# EAGLE design SatUplink-Voltera (EAGLE 8.2.2)
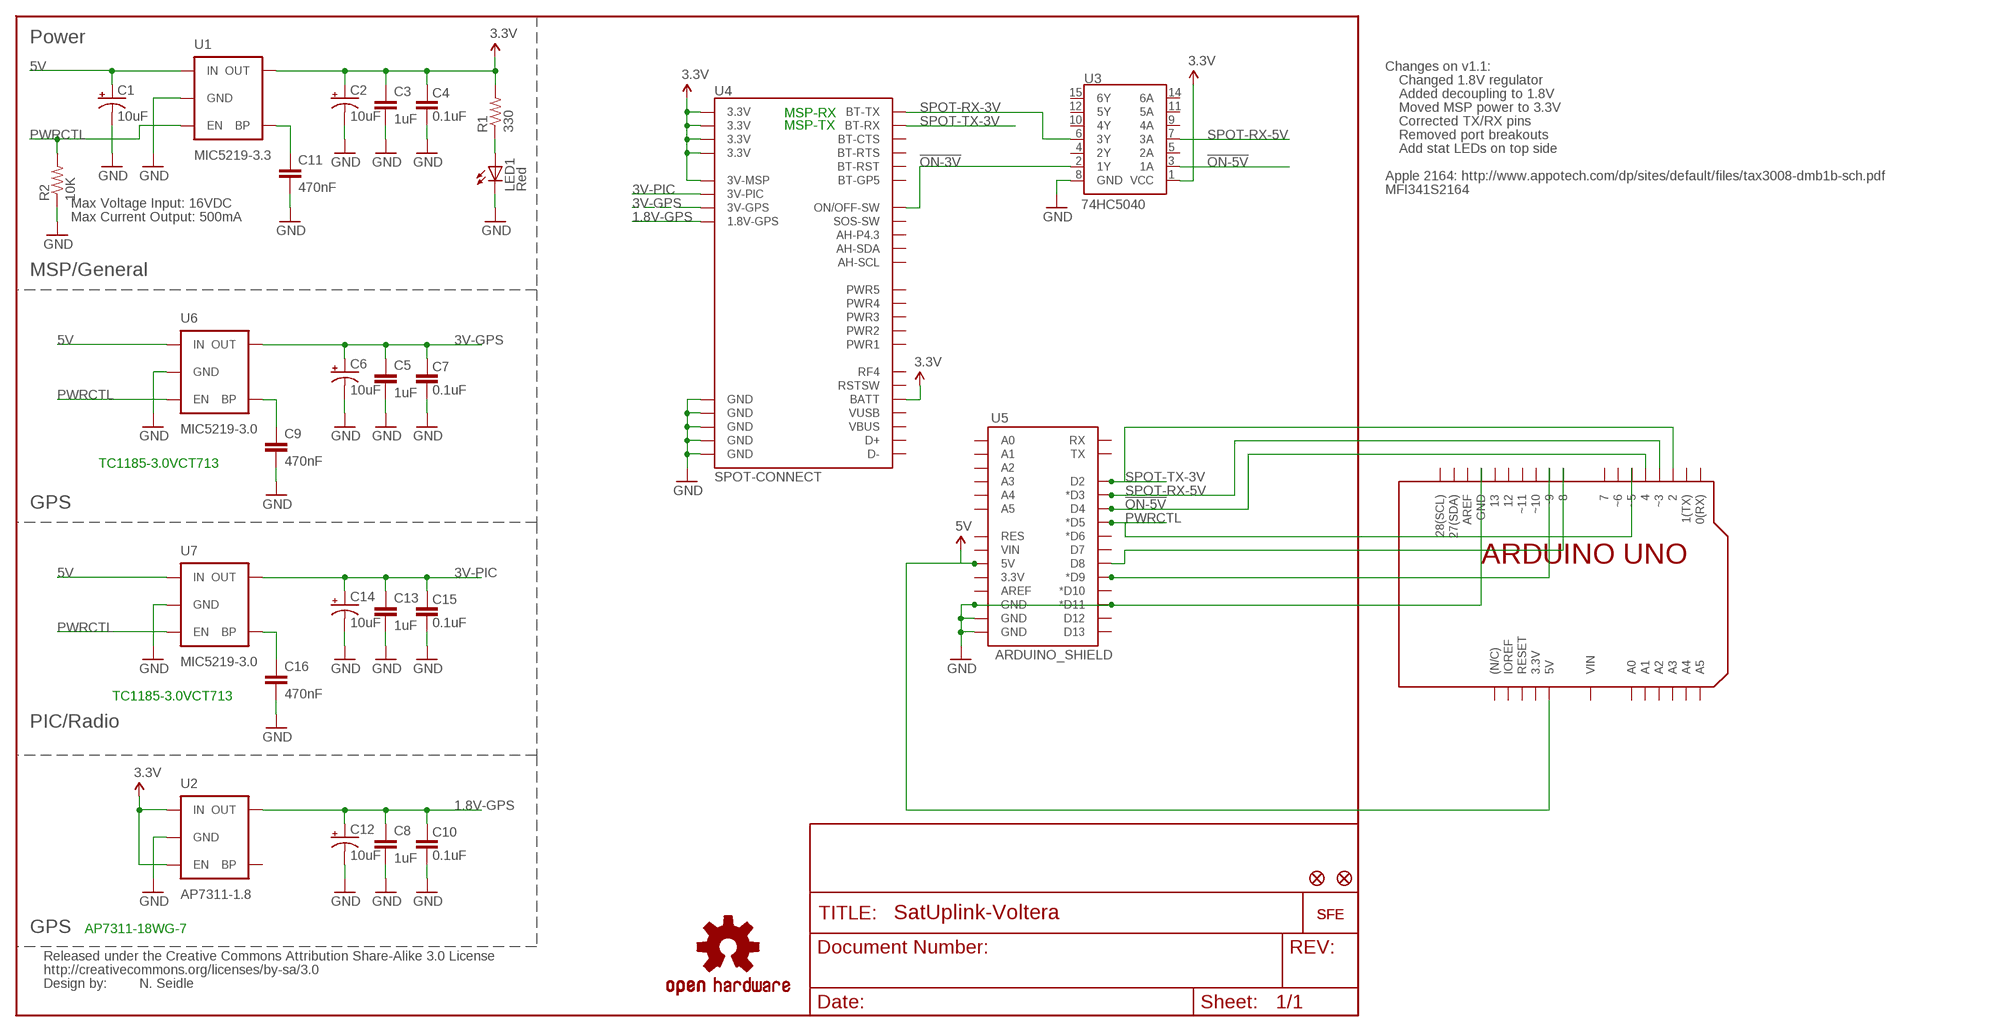
[diagram p0: schematic, sheet 1]

## Parts
C1  10uF  CAP_POL1206  [EIA3216]
C2  10uF  CAP_POL1206  [EIA3216]
C3  1uF  CAP0402-CAP  [0402-CAP]
C4  0.1uF  CAP0402-CAP  [0402-CAP]
C5  1uF  CAP0402-CAP  [0402-CAP]
C6  10uF  CAP_POL1206  [EIA3216]
C7  0.1uF  CAP0402-CAP  [0402-CAP]
C8  1uF  CAP0402-CAP  [0402-CAP]
C9  470nF  CAP0402-CAP  [0402-CAP]
C10  0.1uF  CAP0402-CAP  [0402-CAP]
C11  470nF  CAP0402-CAP  [0402-CAP]
C12  10uF  CAP_POL1206  [EIA3216]
C13  1uF  CAP0402-CAP  [0402-CAP]
C14  10uF  CAP_POL1206  [EIA3216]
C15  0.1uF  CAP0402-CAP  [0402-CAP]
C16  470nF  CAP0402-CAP  [0402-CAP]
JP10  FIDUCIALUFIDUCIAL  [MICRO-FIDUCIAL]
JP11  FIDUCIALUFIDUCIAL  [MICRO-FIDUCIAL]
LED1  Red  LED0603  [LED-0603]
R1  330  RESISTOR0402-RES  [0402-RES]
R2  10K  RESISTOR0402-RES  [0402-RES]
U1  MIC5219-3.3  V_REG_LDOSMD  [SOT23-5]
U2  AP7311-1.8  V_REG_LDOSMD  [SOT23-5]
U3  74HC5040  HEX_CONVERTER  [SO016]
U4  SPOT-CONNECT  SPOT-CONNECTSMD  [SPOT-CONNECT]
U5  ARDUINO_SHIELD  ARDUINO_SHIELDNO_SILK  [DUEMILANOVE_VIAS]
U6  MIC5219-3.0  V_REG_LDOSMD  [SOT23-5]
U7  MIC5219-3.0  V_REG_LDOSMD  [SOT23-5]
U$1  LOGO-SFESK  [SFE-LOGO-FLAME]
U$2  CREATIVE_COMMONS  [CREATIVE_COMMONS]
U$3  OSHW-LOGOS  [OSHW-LOGO-S]
U$4  TEMPLATE_ARDUINO_UNO_SHIELD  [ARDUINO_UNO]
U$11  LOGO-SFENEW  [SFE-NEW-WEBLOGO]

## Nets
1.8V-GPS: C8.1 C10.2 C12.A(+) U2.5(OUT) U4.1.8V-GPS
3.3V: C2.A(+) C3.1 C4.2 R1.2 U1.5(OUT) U2.1(IN) U2.3(EN) U3.1(VCC) U4.3.3V@1(3.3V) U4.3.3V@2(3.3V) U4.3.3V@3(3.3V) U4.3.3V@4(3.3V) U4.3VMSP(3V-MSP) U4.BATT
3V-GPS: C5.1 C6.A(+) C7.2 U4.3V-GPS U6.5(OUT)
3V-PIC: C13.1 C14.A(+) C15.2 U4.3VPIC(3V-PIC) U7.5(OUT)
5V [vcc]: C1.A(+) U1.1(IN) U5.5V U6.1(IN) U7.1(IN) U$4.5V@1(5V) U$4.5V@2(5V)
!ON-3V: U3.2(1Y) U4.ON/OFF(ON/OFF-SW)
!ON-5V: U3.3(1A) U5.D4 U$4.4@1 U$4.4@2
GND [vcc]: C1.C(-) C2.C(-) C3.2 C4.1 C5.2 C6.C(-) C7.1 C8.2 C9.2 C10.1 C11.2 C12.C(-) C13.2 C14.C(-) C15.1 C16.2 LED1.C R2.1 U1.2(GND) U2.2(GND) U3.8(GND) U4.GND@1(GND) U4.GND@2(GND) U4.GND@3(GND) U4.GND@4(GND) U4.GND@5(GND) U5.D11(*D11) U5.GND@0(GND) U5.GND@1(GND) U5.GND@2(GND) U6.2(GND) U7.2(GND) U$4.GND..@1(GND) U$4.GND..@2(GND) U$4.GND.@1(GND) U$4.GND.@2(GND) U$4.GND@1(GND) U$4.GND@2(GND)
N$1: C16.1 U7.4(BP)
N$4: C9.1 U6.4(BP)
N$7: U5.D8 U$4.8@1 U$4.8@2
N$8: U5.D9(*D9) U$4.9@1(~9) U$4.9@2(~9)
N$26: C11.1 U1.4(BP)
N$38: LED1.A R1.1
PWRCTL [vcc]: R2.2 U1.3(EN) U5.D5(*D5) U6.3(EN) U7.3(EN) U$4.5@1(~5) U$4.5@2(~5)
SPOT-RX-3V: U3.6(3Y) U4.BT-TX
SPOT-RX-5V: U3.7(3A) U5.D3(*D3) U$4.3@1(~3) U$4.3@2(~3)
SPOT-TX-3V: U4.BT-RX U5.D2 U$4.2@1 U$4.2@2
Unconnected: U2.4(BP) U3.4(2Y) U3.5(2A) U3.9(4A) U3.10(4Y) U3.11(5A) U3.12(5Y) U3.14(6A) U3.15(6Y) U4.AH-SCL U4.AH/P4.3(AH-P4.3) U4.AH/SDA(AH-SDA) U4.BT-CTS U4.BT-GP5 U4.BT-RST U4.BT-RTS U4.D+ U4.D- U4.PWRCTL1(PWR1) U4.PWRCTL2(PWR2) U4.PWRCTL3(PWR3) U4.PWRCTL4(PWR4) U4.PWRCTL5(PWR5) U4.RF4 U4.RSTSW U4.SOS(SOS-SW) U4.VBUS U4.VUSB U5.3.3V U5.A0 U5.A1 U5.A2 U5.A3 U5.A4 U5.A5 U5.AREF U5.D6(*D6) U5.D7 U5.D10(*D10) U5.D12 U5.D13 U5.RES U5.RX U5.TX U5.VIN U$4.0@1(0(RX)) U$4.0@2(0(RX)) U$4.1@1(1(TX)) U$4.1@2(1(TX)) U$4.3.3V@1(3.3V) U$4.3.3V@2(3.3V) U$4.6@1(~6) U$4.6@2(~6) U$4.7@1 U$4.7@2 U$4.10@1(~10) U$4.10@2(~10) U$4.11@1(~11) U$4.11@2(~11) U$4.12@1 U$4.12@2 U$4.13@1 U$4.13@2 U$4.A0@1(A0) U$4.A0@2(A0) U$4.A1@1(A1) U$4.A1@2(A1) U$4.A2@1(A2) U$4.A2@2(A2) U$4.A3@1(A3) U$4.A3@2(A3) U$4.A4@1(A4) U$4.A4@2(A4) U$4.A5@1(A5) U$4.A5@2(A5) U$4.AREF@1(AREF) U$4.AREF@2(AREF) U$4.I/OREF@1(IOREF) U$4.I/OREF@2(IOREF) U$4.N/C@1((N/C)) U$4.N/C@2((N/C)) U$4.RESET@1(RESET) U$4.RESET@2(RESET) U$4.SCL@1(28(SCL)) U$4.SCL@2(28(SCL)) U$4.SDA@1(27(SDA)) U$4.SDA@2(27(SDA)) U$4.VIN@1(VIN) U$4.VIN@2(VIN)

## Notes on the sheet
- Power
- Changes on v1.1:
- Changed 1.8V regulator
- Added decoupling to 1.8V
- Moved MSP power to 3.3V
- MSP-RX
- Corrected TX/RX pins
- MSP-TX
- Removed port breakouts
- Add stat LEDs on top side
- Apple 2164: http://www.appotech.com/dp/sites/default/files/tax3008-dmb1b-sch.pdf
- MFI341S2164
- Max Voltage Input: 16VDC
- Max Current Output: 500mA
- MSP/General
- TC1185-3.0VCT713
- GPS
- TC1185-3.0VCT713
- PIC/Radio
- GPS | AP7311-18WG-7
- N. Seidle

## Library data of the parts
C1 C2 C6 C12 C14 = SparkFun:CAP_POL: Capacitor Polarized These are standard SMD and PTH capacitors. Normally 10uF, 47uF, and 100uF in electrolytic and tantalum varieties. Always verify the external diameter of the through hole cap, it varies with capacity, voltage, and manufacturer. The EIA devices should be standard.
C3-C5 C7-C11 C13 C15 C16 = SparkFun:CAP: Capacitor Standard 0603 ceramic capacitor, and 0.1" leaded capacitor.
JP10 JP11 = SparkFun:FIDUCIAL: Fiducial Alignment Points Various fiducial points for machine vision alignment.
LED1 = SparkFun:LED: LEDs Standard schematic elements and footprints for 5mm, 3mm, 1206, and 0603 sized LEDs. 5mm - Spark Fun Electronics SKU : COM-00529 (and others)
R1 R2 = SparkFun:RESISTOR: Resistor Basic schematic elements and footprints for 0603, 1206, and PTH resistors.
U1 U2 U6 U7 = SparkFun:V_REG_LDO: Voltage Regulator LDO Standard 150mA LDO voltage regulator in SOT-23 layout. Micrel part MIC5205. BP (by-pass) pin is used to lower output noise with 470pF cap.
U3 = SparkFun:HEX_CONVERTER
U4 = SparkFun:SPOT-CONNECT
U5 = SparkFun:ARDUINO_SHIELD
U$1 U$11 = SparkFun:LOGO-SFE: Spark Fun Electronics PCB Logo This is the standard Spark Fun Electronics PCB logo.
U$2 = SparkFun:CREATIVE_COMMONS
U$3 = SparkFun:OSHW-LOGO: Open Source Hardware Logo This logo indicates the piece of hardware it is found on incorporates a OSHW license and/or adheres to the definition of open source hardware found here: http://freedomdefined.org/OSHW
U$4 = voltera_EAGLE_community_lib:TEMPLATE_ARDUINO_UNO: Use SHIELD for integrating into circuits. Use RAW for created the template boards.

## Net classes
0 default: width 0.203 mm

## Board
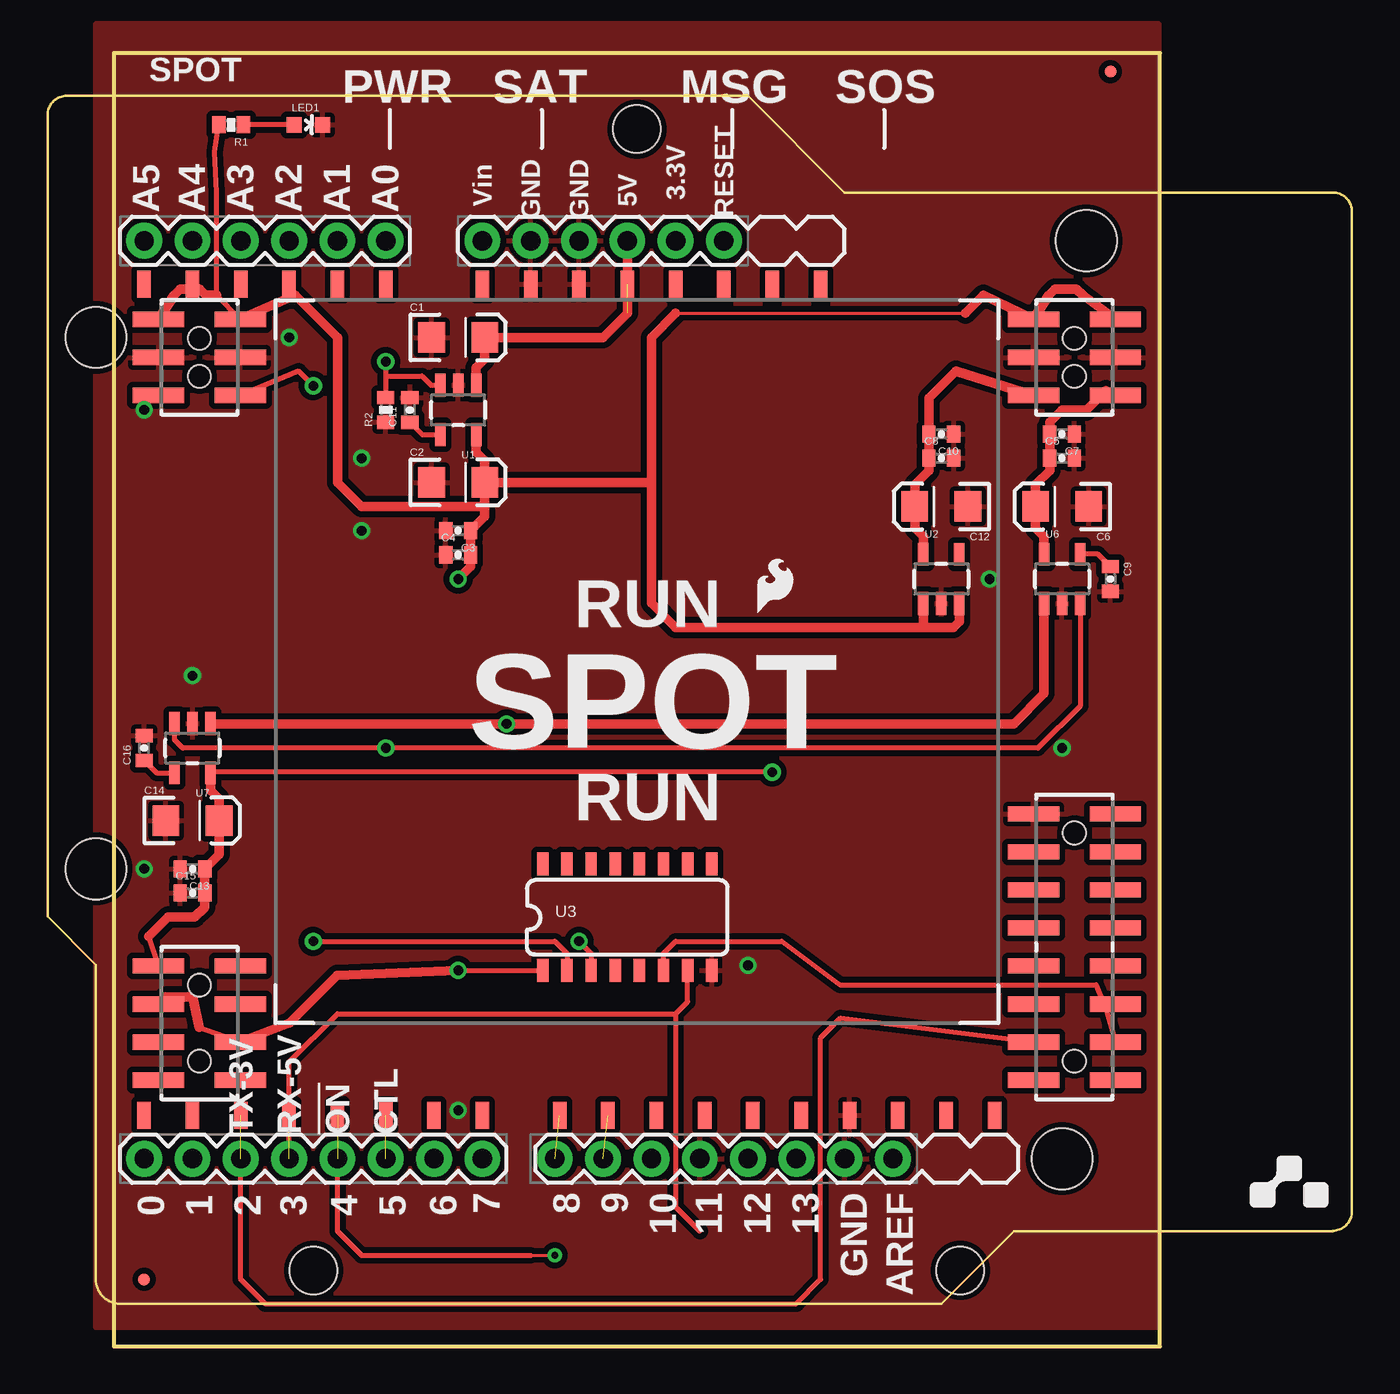
[diagram p1: board, top side]
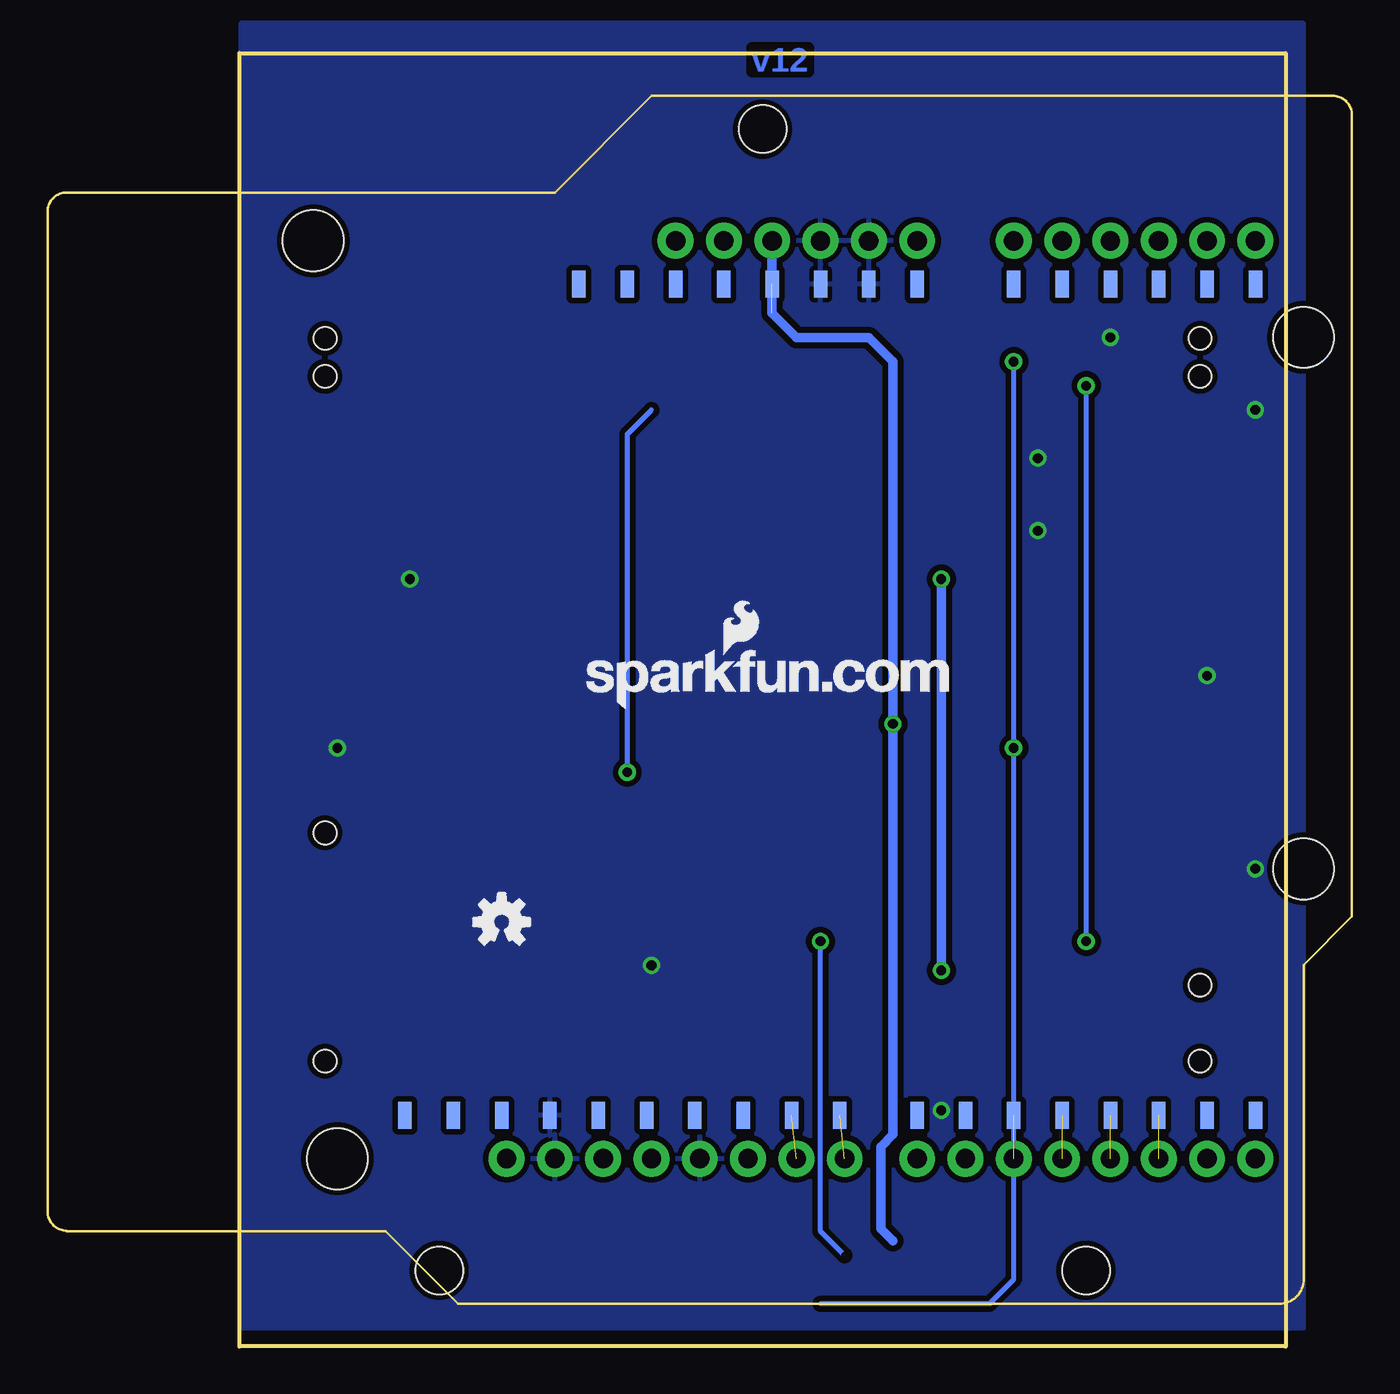
[diagram p2: board, bottom side, seen from below]

Size 68.58 x 68 mm. Coordinates in mm from the lower left corner, seen from the top.
Copper layers (1*2)+(15*16): Top 0.035mm / dielectric 1.5mm / Route2 0.035mm / dielectric 0.15mm / Route15 0.035mm / dielectric 0.2mm / Bottom 0.035mm
Design rules "Voltera_DRC *": minimum track width 10mil, minimum drill 0.6mm, track to track 10mil, track to pad 10mil, pad to pad 0.6mm, via to via 0.6mm, smd to smd 0mil, copper to edge 0mil, drill to drill 0.8mm, minimum pad ring 0.2mm, minimum via ring 0.2mm, stop-mask expansion 4mil, vias tented up to drill 0mil, thermal gap 10mil

### Footprints (pad centres in the part's own frame; a part is rotated, then mirrored left to right if it is on the bottom)
EIA3216 = smd 1.4 x 1.6: A 1.4,0; C -1.4,0
0402-CAP = smd 0.7 x 0.9: 1 -0.65,0; 2 0.65,0
MICRO-FIDUCIAL = smd 0.635 x 0.635: 1 0,0
LED-0603 = smd 0.8 x 0.8: A 0,-0.75; C 0,0.75
0402-RES = smd 0.7 x 0.9: 1 -0.65,0; 2 0.65,0
SOT23-5 = smd 0.55 x 1.2: 1 -0.95,-1.3; 2 0,-1.3; 3 0.95,-1.3; 4 0.95,1.3; 5 -0.95,1.3
SO016 = smd 0.6 x 1.2: 1 -4.445,-2.8; 2 -3.175,-2.8; 3 -1.905,-2.8; 4 -0.635,-2.8; 5 0.635,-2.8; 6 1.905,-2.8; 7 3.175,-2.8; 8 4.445,-2.8; 9 4.445,2.8; 10 3.175,2.8; 11 1.905,2.8; 12 0.635,2.8; 13 -0.635,2.8; 14 -1.905,2.8; 15 -3.175,2.8; 16 -4.445,2.8
SPOT-CONNECT = smd 2.7 x 0.8: 1.8V-GPS 20.85,16; 3.3V@1 -25.15,20; 3.3V@2 -20.85,20; 3.3V@3 20.85,20; 3.3V@4 25.15,20; 3V-GPS 25.15,16; 3VMSP -25.15,-16; 3VPIC -25.15,-14; AH-SCL 25.15,-12; AH/P4.3 20.85,-14; AH/SDA 20.85,-12; BATT -20.85,-18; BT-CTS 20.85,-16; BT-GP5 25.15,-16; BT-RST 25.15,-14; BT-RTS 20.85,-20; BT-RX 20.85,-18; BT-TX 25.15,-18; D+ -20.85,-20; D- -25.15,-20; GND@1 -25.15,18; GND@2 -20.85,18; GND@3 20.85,18; GND@4 25.15,18; GND@5 20.85,-6; ON/OFF -20.85,16; PWRCTL1 25.15,-10; PWRCTL2 25.15,-8; PWRCTL3 25.15,-6; PWRCTL4 20.85,-10; PWRCTL5 20.85,-8; RF4 -20.85,-14; RSTSW -25.15,-18; SOS -25.15,16; VBUS 25.15,-20; VUSB -20.85,-16 | hole 2.5: 0,30; 17,-30; -17,-30 | hole 1.2: 23,-19; 23,-7; -23,-15; -23,-19; -23,17; -23,19; 23,17; 23,19
DUEMILANOVE_VIAS = drill 1.016 pad 1.88: 3.3V 50.8,13.97; 5V 50.8,16.51; A0 50.8,29.21; A1 50.8,31.75; A2 50.8,34.29; A3 50.8,36.83; A4 50.8,39.37; A5 50.8,41.91; AREF 2.54,2.54; D2 2.54,36.83; D3 2.54,34.29; D4 2.54,31.75; D5 2.54,29.21; D6 2.54,26.67; D7 2.54,24.13; D8 2.54,20.32; D9 2.54,17.78; D10 2.54,15.24; D11 2.54,12.7; D12 2.54,10.16; D13 2.54,7.62; GND@0 50.8,19.05; GND@1 50.8,21.59; GND@2 2.54,5.08; RES 50.8,11.43; RX 2.54,41.91; TX 2.54,39.37; VIN 50.8,24.13
ARDUINO_UNO = smd 0.711 x 1.422 bottom: 0@1 30.48,23.114; 1@1 27.94,23.114; 2@1 25.4,23.114; 3.3V@1 2.54,-20.574; 3@1 22.86,23.114; 4@1 20.32,23.114; 5@1 17.78,23.114; 5V@1 5.08,-20.574; 6@1 15.24,23.114; 7@1 12.7,23.114; 8@1 8.636,23.114; 9@1 6.096,23.114; 10@1 3.556,23.114; 11@1 1.016,23.114; 12@1 -1.524,23.114; 13@1 -4.064,23.114; A0@1 17.78,-20.574; A1@1 20.32,-20.574; A2@1 22.86,-20.574; A3@1 25.4,-20.574; A4@1 27.94,-20.574; A5@1 30.48,-20.574; AREF@1 -9.144,23.114; GND..@1 7.62,-20.574; GND.@1 10.16,-20.574; GND@1 -6.604,23.114; I/OREF@1 -2.54,-20.574; N/C@1 -5.08,-20.574; RESET@1 0,-20.574; SCL@1 -14.224,23.114; SDA@1 -11.684,23.114; VIN@1 12.7,-20.574 | smd 0.711 x 1.422: 0@2 30.48,23.114; 1@2 27.94,23.114; 2@2 25.4,23.114; 3.3V@2 2.54,-20.574; 3@2 22.86,23.114; 4@2 20.32,23.114; 5@2 17.78,23.114; 5V@2 5.08,-20.574; 6@2 15.24,23.114; 7@2 12.7,23.114; 8@2 8.636,23.114; 9@2 6.096,23.114; 10@2 3.556,23.114; 11@2 1.016,23.114; 12@2 -1.524,23.114; 13@2 -4.064,23.114; A0@2 17.78,-20.574; A1@2 20.32,-20.574; A2@2 22.86,-20.574; A3@2 25.4,-20.574; A4@2 27.94,-20.574; A5@2 30.48,-20.574; AREF@2 -9.144,23.114; GND..@2 7.62,-20.574; GND.@2 10.16,-20.574; GND@2 -6.604,23.114; I/OREF@2 -2.54,-20.574; N/C@2 -5.08,-20.574; RESET@2 0,-20.574; SCL@2 -14.224,23.114; SDA@2 -11.684,23.114; VIN@2 12.7,-20.574 | hole 3.2: 33.02,-17.78; 33.02,10.16; -17.78,25.4; -19.05,-22.86

### Placement (x,y rotation side)
C1  21.59,53.05 0 top
C2  21.59,45.43 0 top
C3  21.59,42.89 180 top
C4  21.59,41.62 0 top
C5  53.34,46.7 0 top
C6  53.34,44.16 180 top
C7  53.34,47.97 180 top
C8  46.99,46.7 0 top
C9  55.88,40.35 270 top
C10  46.99,47.97 180 top
C11  19.05,49.24 90 top
C12  46.99,44.16 180 top
C13  7.62,25.11 180 top
C14  7.62,27.65 0 top
C15  7.62,23.84 0 top
C16  5.08,31.46 90 top
JP10  55.88,67.02 90 top
JP11  5.08,3.52 90 top
LED1  13.72,64.23 270 top
R1  9.65,64.23 180 top
R2  17.78,49.24 90 top
U1  21.59,49.24 180 top
U2  46.99,40.35 0 top
U3  30.48,22.57 0 top
U4  30.99,34 0 top
U5  46.99,7.33 90 top
U6  53.34,40.35 0 top
U7  7.62,31.46 180 top
U$1  37.34,38.57 0 top
U$2  -0.76,-8.93 0 top  (outside the outline)
U$3  44.7,22.32 0 bottom
U$4  35.56,35.27 180 top
U$11  40.26,33.49 0 bottom

### Tracks (layer width: path | path; a pad name or v marks a point on that pad's centre or on a via)
1.8V-GPS
  Top 0.508: U4.1.8V-GPS 47.75,51.27 46.34,49.86 C10.2 C8.1 46.34,46.05 45.59,45.3 C12.A 45.59,43.02 46.04,42.57 U2.5
3.3V  (via drill 0.51)
  Top 0.152: 33.02,54.32 48.26,54.32
  Top 0.254: 7.97,16.76 U4.BATT | v21.59,19.77 U3.1 | U4.3.3V@2 8.89,55.27 8.89,60.67 8.78,62.81 R1.2
  Top 0.508: 7.97,16.76 7.62,18.38 6.22,18.38 U4.3VMSP | U4.BATT 12.73,17.02 15.23,19.52 v21.59,19.77 | 22.99,44.16 22.99,43.64 C3.1 C4.2 22.24,41 v21.59,40.35 | 22.99,44.16 C2.A | 48.26,54.32 49.21,55.27 U4.3.3V@3 52.64,55.27 52.96,55.59 54.1,55.59 54.42,55.27 U4.3.3V@4 | 31.75,45.43 31.75,39.08 33.02,37.81 46.1,37.81 | U4.3.3V@2 13.02,55.27 15.24,53.05 15.24,45.43 16.51,44.16 22.99,44.16 | U1.5 22.54,47.02 22.99,46.57 C2.A | C2.A 31.75,45.43 | 33.02,54.32 31.75,53.05 31.75,45.43 | 8.89,55.27 8.32,55.27 8,55.59 6.99,55.59 6.67,55.27 U4.3.3V@1 | U2.3 47.94,38.12 47.62,37.81 46.1,37.81 | U2.1 46.04,37.87 46.1,37.81
  Bottom 0.508: v21.59,40.35 v21.59,19.77
3V-GPS
  Top 0.508: U4.3V-GPS 55.63,50.26 54.61,49.24 53.34,49.24 52.69,48.59 C7.2 C5.1 52.69,46.05 51.94,45.3 C6.A 51.94,43.02 52.39,42.57 U6.5
3V-PIC  (via drill 0.51)
  Top 0.254: U4.3VPIC 5.33,21.55 | v38.1,30.19 8.6,30.19 U7.5
  Top 0.508: U7.5 8.57,29.24 9.02,28.79 C14.A 9.02,25.86 C13.1 C15.2 8.27,23.09 7.75,22.57 6.35,22.57 5.33,21.55
  Bottom 0.254: v38.1,30.19 38.1,47.97 36.83,49.24
5V  (via drill 0.51)  (1 unrouted)
  Top 0.508: U1.1 22.54,51.46 22.99,51.91 C1.A 29.21,53.05 30.48,54.32 U5.5V | U7.1 8.6,32.73 v24.13,32.73 50.8,32.73 52.39,34.32 U6.1
  Bottom 0.508: 24.13,5.55 24.77,6.19 24.77,10.51 24.13,11.14 v24.13,32.73 24.13,51.78 25.4,53.05 29.21,53.05 30.48,54.32 U5.5V
!ON-3V  (via drill 0.51)
  Top 0.254: U3.2 27.31,20.67 26.67,21.3 v13.97,21.3 | U4.ON/OFF 13.21,51.27 v13.97,50.51
  Bottom 0.254: v13.97,21.3 v13.97,50.51
!ON-5V  (via drill 0.35 layers 1-2, 0.51)  (2 unrouted)
  Top 0.152: 25.4,4.79 v26.67,4.79
  Top 0.254: 25.4,4.79 16.51,4.79 15.24,6.06 U5.D4 | U3.3 28.58,20.67 v27.94,21.3
  Bottom 0.254: v26.67,4.79 27.94,6.06 v27.94,21.3
GND  (via drill 0.51)
  other vias: 16.51,46.7 16.51,42.89 5.08,49.24 5.08,25.11 36.83,20.03 53.34,31.46 49.53,40.35 12.7,53.05 21.59,12.41 7.62,35.27
  pour Top (isolate 0.305): 2.54,0.98 2.54,69.56 58.42,69.56 58.42,0.98
  pour Bottom (isolate 0.305): 2.54,0.98 2.54,69.56 58.42,69.56 58.42,0.98
N$1
  Top 0.254: U7.4 5.73,30.16 C16.1
N$4
  Top 0.254: U6.4 55.23,41.65 C9.1
N$7  (1 unrouted)
N$8  (1 unrouted)
N$26
  Top 0.254: U1.4 19.7,47.94 C11.1
N$38
  Top 0.254: LED1.A R1.1
PWRCTL  (via drill 0.51)  (1 unrouted)
  Top 0.254: v17.78,51.78 17.78,51.02 | 17.78,51.02 R2.2 | U1.3 20.16,50.54 19.69,51.02 17.78,51.02 | U6.3 54.29,33.68 52.07,31.46 v17.78,31.46 7.11,31.46 6.67,31.9 U7.3
  Bottom 0.254: 27.94,2.25 19.05,2.25 17.78,3.52 U5.D5 v17.78,31.46 v17.78,51.78
SPOT-RX-3V
  Top 0.254: U3.6 32.39,20.67 33.02,21.3 38.61,21.3 41.66,19.01 55.12,19.01 55.63,17.74 U4.BT-TX
SPOT-RX-5V  (1 unrouted)
  Top 0.254: 34.29,6.06 33.02,7.33 33.02,17.49 | U5.D3 12.7,14.95 15.24,17.49 33.02,17.49 | U3.7 33.66,18.12 33.02,17.49
SPOT-TX-3V  (1 unrouted)
  Top 0.254: U5.D2 10.16,3.52 11.43,2.25 39.37,2.25 40.64,3.52 40.64,16.22 41.69,17.27 U4.BT-RX

### Text on the board
Bottom: v12
tPlace: SPOT | TX-3V | RX-5V | !ON | CTL | N. Seidle